# Altium schematic sheet 74HC595_use.SchDoc
size A4; SheetNumber: 2; SheetTotal: 2
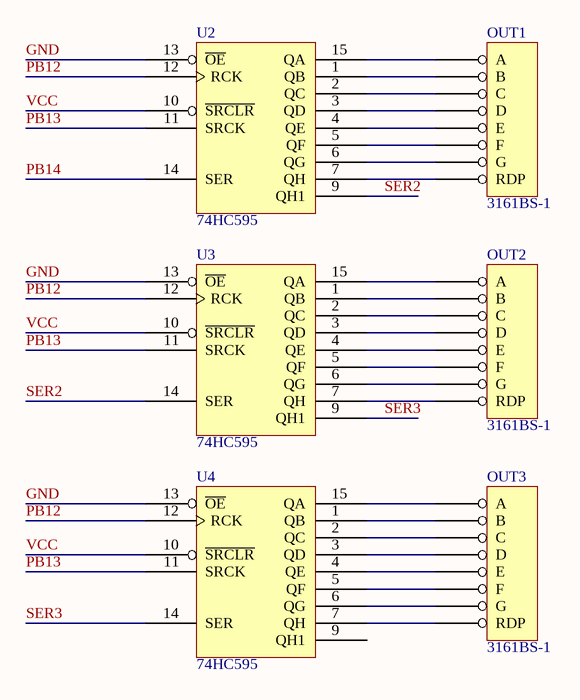
[diagram p0: 74HC595_use.SchDoc]

## Parts
OUT1  3161BS-1
OUT2  3161BS-1
OUT3  3161BS-1
U2  74HC595  [SOP16]
U3  74HC595  [SOP16]
U4  74HC595  [SOP16]

## Nets
GND: U2.8(GND) U3.8(GND) U4.8(GND)
VCC: U2.16(VCC) U3.16(VCC) U4.16(VCC)
NetOUT1_2: OUT1.2(A) U2.15(QA)
NetOUT1_3: OUT1.3(B) U2.1(QB)
NetOUT1_4: OUT1.4(C) U2.2(QC)
NetOUT1_5: OUT1.5(D) U2.3(QD)
NetOUT1_6: OUT1.6(E) U2.4(QE)
NetOUT1_7: OUT1.7(F) U2.5(QF)
NetOUT1_8: OUT1.8(G) U2.6(QG)
NetOUT1_9: OUT1.9(RDP) U2.7(QH)
NetOUT2_2: OUT2.2(A) U3.15(QA)
NetOUT2_3: OUT2.3(B) U3.1(QB)
NetOUT2_4: OUT2.4(C) U3.2(QC)
NetOUT2_5: OUT2.5(D) U3.3(QD)
NetOUT2_6: OUT2.6(E) U3.4(QE)
NetOUT2_7: OUT2.7(F) U3.5(QF)
NetOUT2_8: OUT2.8(G) U3.6(QG)
NetOUT2_9: OUT2.9(RDP) U3.7(QH)
NetOUT3_2: OUT3.2(A) U4.15(QA)
NetOUT3_3: OUT3.3(B) U4.1(QB)
NetOUT3_4: OUT3.4(C) U4.2(QC)
NetOUT3_5: OUT3.5(D) U4.3(QD)
NetOUT3_6: OUT3.6(E) U4.4(QE)
NetOUT3_7: OUT3.7(F) U4.5(QF)
NetOUT3_8: OUT3.8(G) U4.6(QG)
NetOUT3_9: OUT3.9(RDP) U4.7(QH)

Not connected (* = marked no-connect by the designer): U2 9(QH1) 10(~{SRCLR}) 11(SRCK) 12(RCK) 13(~{OE}) 14(SER); U3 9(QH1) 10(~{SRCLR}) 11(SRCK) 12(RCK) 13(~{OE}) 14(SER); U4 9(QH1) 10(~{SRCLR}) 11(SRCK) 12(RCK) 13(~{OE}) 14(SER)

## Notes on the sheet
- GND
- PB12
- VCC
- PB13
- PB14
- SER2
- SER3

## Library data of the parts
U2-U4 = 74HC595: 8位串行输入/8位串行或并行输出 存储状态寄存器